# Altium project MAINBOARD.PRJPCB
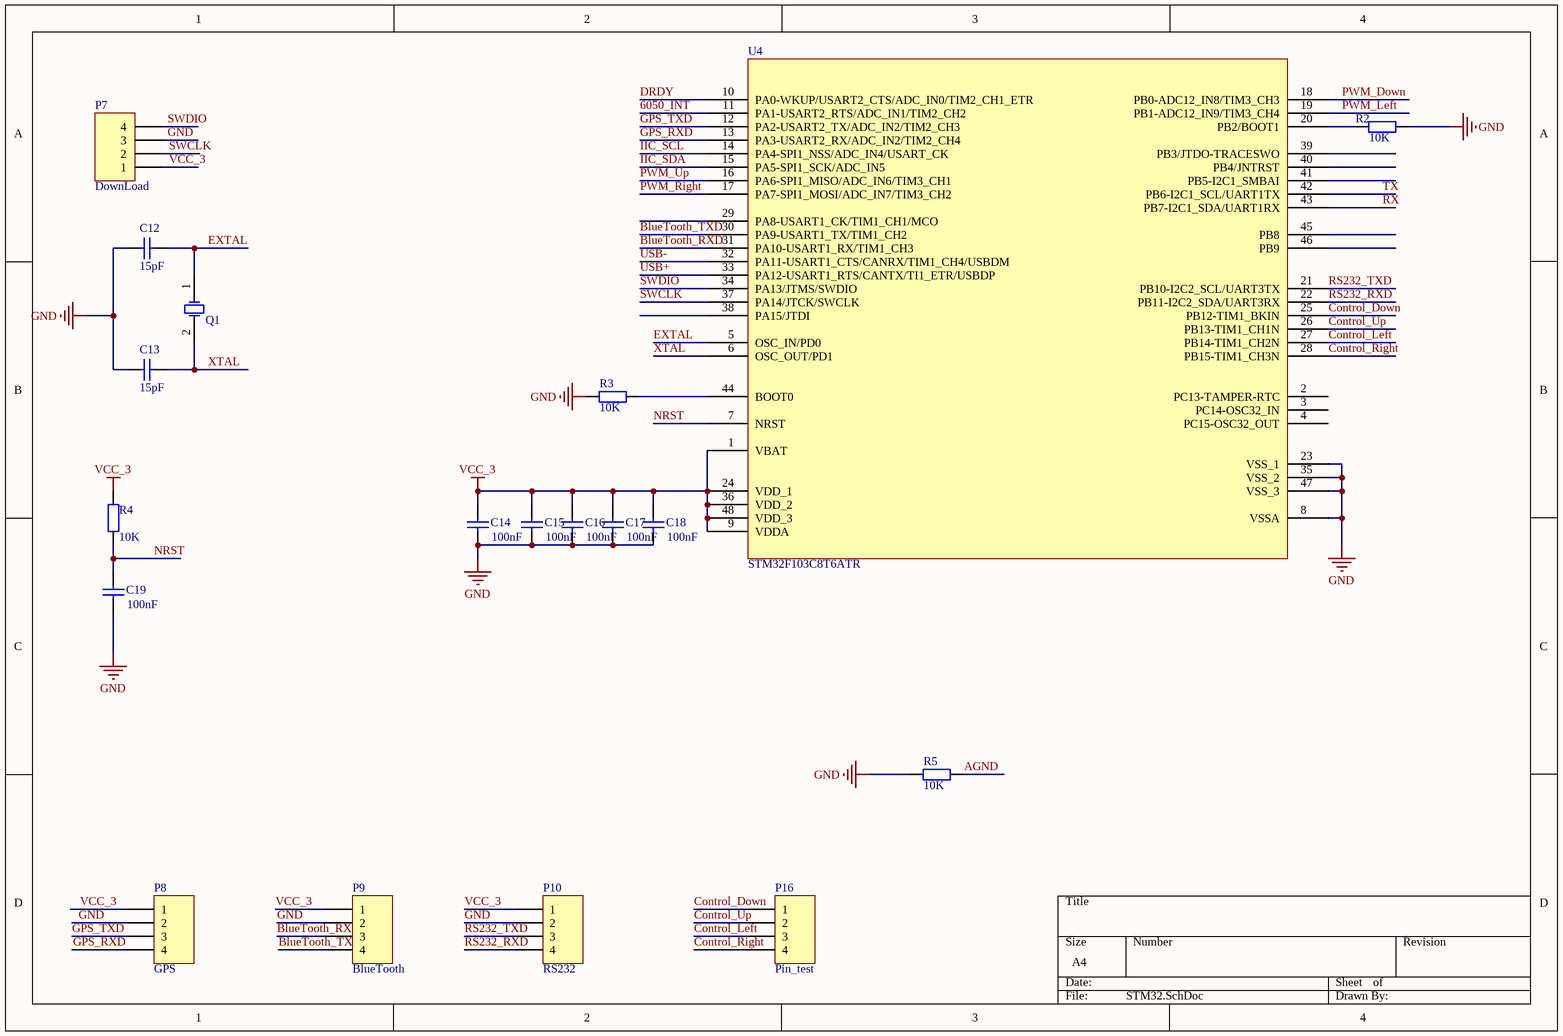
[diagram p0: STM32.SchDoc]
3 sheets, 49 parts. Net scope: global (net labels, ports and power ports of the same name join across sheets).
Board file: mainboard.PcbDoc
Sheets:
  STM32.SchDoc
  mainboard.SchDoc
  power.SchDoc

## Sheet STM32.SchDoc
size A4

### Parts
C12  value 15pF  [0603]  (hidden comment: 1pF)
C13  value 15pF  [0603]  (hidden comment: 1pF)
C14  value 100nF  [0603]  (hidden comment: Cap)
C15  value 100nF  [0603]  (hidden comment: Cap)
C16  value 100nF  [0603]  (hidden comment: Cap)
C17  value 100nF  [0603]  (hidden comment: Cap)
C18  value 100nF  [0603]  (hidden comment: Cap)
C19  value 100nF  [0603]  (hidden comment: Cap)
P7  DownLoad  [HDR1X4]
P8  GPS  [HDR1X4]
P9  BlueTooth  [HDR1X4]
P10  RS232  [HDR1X4]
P16  Pin_test  [HDR1X4]
Q1  XTAL  [xtal-5032]  (value not drawn)
R2  value 10K  [0603]  (hidden comment: Res2)
R3  value 10K  [0603]  (hidden comment: Res2)
R4  value 10K  [0603]  (hidden comment: Res2)
R5  value 10K  [0603]  (hidden comment: Res2)
U4  STM32F103C8T6ATR

### Nets
GND: C12.1 C13.1 C14.1 C15.1 C16.1 C17.1 C18.1 C19.1 P7.3 P8.2 P9.2 P10.2 R2.1 R3.2 R5.2 U4.8(VSSA) U4.23(VSS_1) U4.35(VSS_2) U4.47(VSS_3)
VCC_3: C14.2 C15.2 C16.2 C17.2 C18.2 P7.1 P8.1 P9.1 P10.1 R4.2 U4.1(VBAT) U4.9(VDDA) U4.24(VDD_1) U4.36(VDD_2) U4.48(VDD_3)
6050_INT: U4.11(PA1-USART2_RTS/ADC_IN1/TIM2_CH2)
AGND: R5.1
BlueTooth_RXD: P9.3 U4.31(PA10-USART1_RX/TIM1_CH3)
BlueTooth_TXD: P9.4 U4.30(PA9-USART1_TX/TIM1_CH2)
Control_Down: P16.1 U4.25(PB12-TIM1_BKIN)
Control_Left: P16.3 U4.27(PB14-TIM1_CH2N)
Control_Right: P16.4 U4.28(PB15-TIM1_CH3N)
Control_Up: P16.2 U4.26(PB13-TIM1_CH1N)
DRDY: U4.10(PA0-WKUP/USART2_CTS/ADC_IN0/TIM2_CH1_ETR)
EXTAL: C12.2 Q1.1(OSC1) U4.5(OSC_IN/PD0)
GPS_RXD: P8.4 U4.13(PA3-USART2_RX/ADC_IN2/TIM2_CH4)
GPS_TXD: P8.3 U4.12(PA2-USART2_TX/ADC_IN2/TIM2_CH3)
IIC_SCL: U4.14(PA4-SPI1_NSS/ADC_IN4/USART_CK)
IIC_SDA: U4.15(PA5-SPI1_SCK/ADC_IN5)
NRST: C19.2 R4.1 U4.7(NRST)
PWM_Down: U4.18(PB0-ADC12_IN8/TIM3_CH3)
PWM_Left: U4.19(PB1-ADC12_IN9/TIM3_CH4)
PWM_Right: U4.17(PA7-SPI1_MOSI/ADC_IN7/TIM3_CH2)
PWM_Up: U4.16(PA6-SPI1_MISO/ADC_IN6/TIM3_CH1)
RS232_RXD: P10.4 U4.22(PB11-I2C2_SDA/UART3RX)
RS232_TXD: P10.3 U4.21(PB10-I2C2_SCL/UART3TX)
RX: U4.43(PB7-I2C1_SDA/UART1RX)
SWCLK: P7.2 U4.37(PA14/JTCK/SWCLK)
SWDIO: P7.4 U4.34(PA13/JTMS/SWDIO)
TX: U4.42(PB6-I2C1_SCL/UART1TX)
USB+: U4.33(PA12-USART1_RTS/CANTX/TI1_ETR/USBDP)
USB-: U4.32(PA11-USART1_CTS/CANRX/TIM1_CH4/USBDM)
XTAL: C13.2 Q1.2(OSC2) U4.6(OSC_OUT/PD1)
NetR2_2: R2.2 U4.20(PB2/BOOT1)
NetR3_1: R3.1 U4.44(BOOT0)

Not connected (* = marked no-connect by the designer): U4 2(PC13-TAMPER-RTC) 3(PC14-OSC32_IN) 4(PC15-OSC32_OUT) 29(PA8-USART1_CK/TIM1_CH1/MCO) 38(PA15/JTDI) 39(PB3/JTDO-TRACESWO) 40(PB4/JNTRST) 41(PB5-I2C1_SMBAI) 45(PB8) 46(PB9)

### Library data of the parts
C12 C13 = Cap Semi: Capacitor (Semiconductor SIM Model); Published: 8-Jun-2000; LatestRevisionDate: 17-Jul-2002; LatestRevisionNote: Re-released for DXP Platform.; PackageReference: C1206; Publisher: Altium Limited
C14-C19 = Cap: Capacitor; Published: 8-Jun-2000; LatestRevisionDate: 17-Jul-2002; LatestRevisionNote: Re-released for DXP Platform.; PackageReference: RAD-0.3; Publisher: Altium Limited
P7-P10 P16 = Header 4: Header, 4-Pin; LatestRevisionDate: 17-Jul-2002; LatestRevisionNote: Re-released for DXP Platform.; Publisher: Altium Limited
Q1 = XTAL: Crystal Oscillator; Published: 8-Jun-2000; LatestRevisionDate: 17-Jul-2002; LatestRevisionNote: Re-released for DXP Platform.; PackageReference: R38; Publisher: Altium Limited
R2-R5 = Res2: Resistor; Published: 8-Jun-2000; LatestRevisionDate: 17-Jul-2002; LatestRevisionNote: Re-released for DXP Platform.; PackageReference: AXIAL-0.4; Publisher: Altium Limited

## Sheet mainboard.SchDoc
size A4
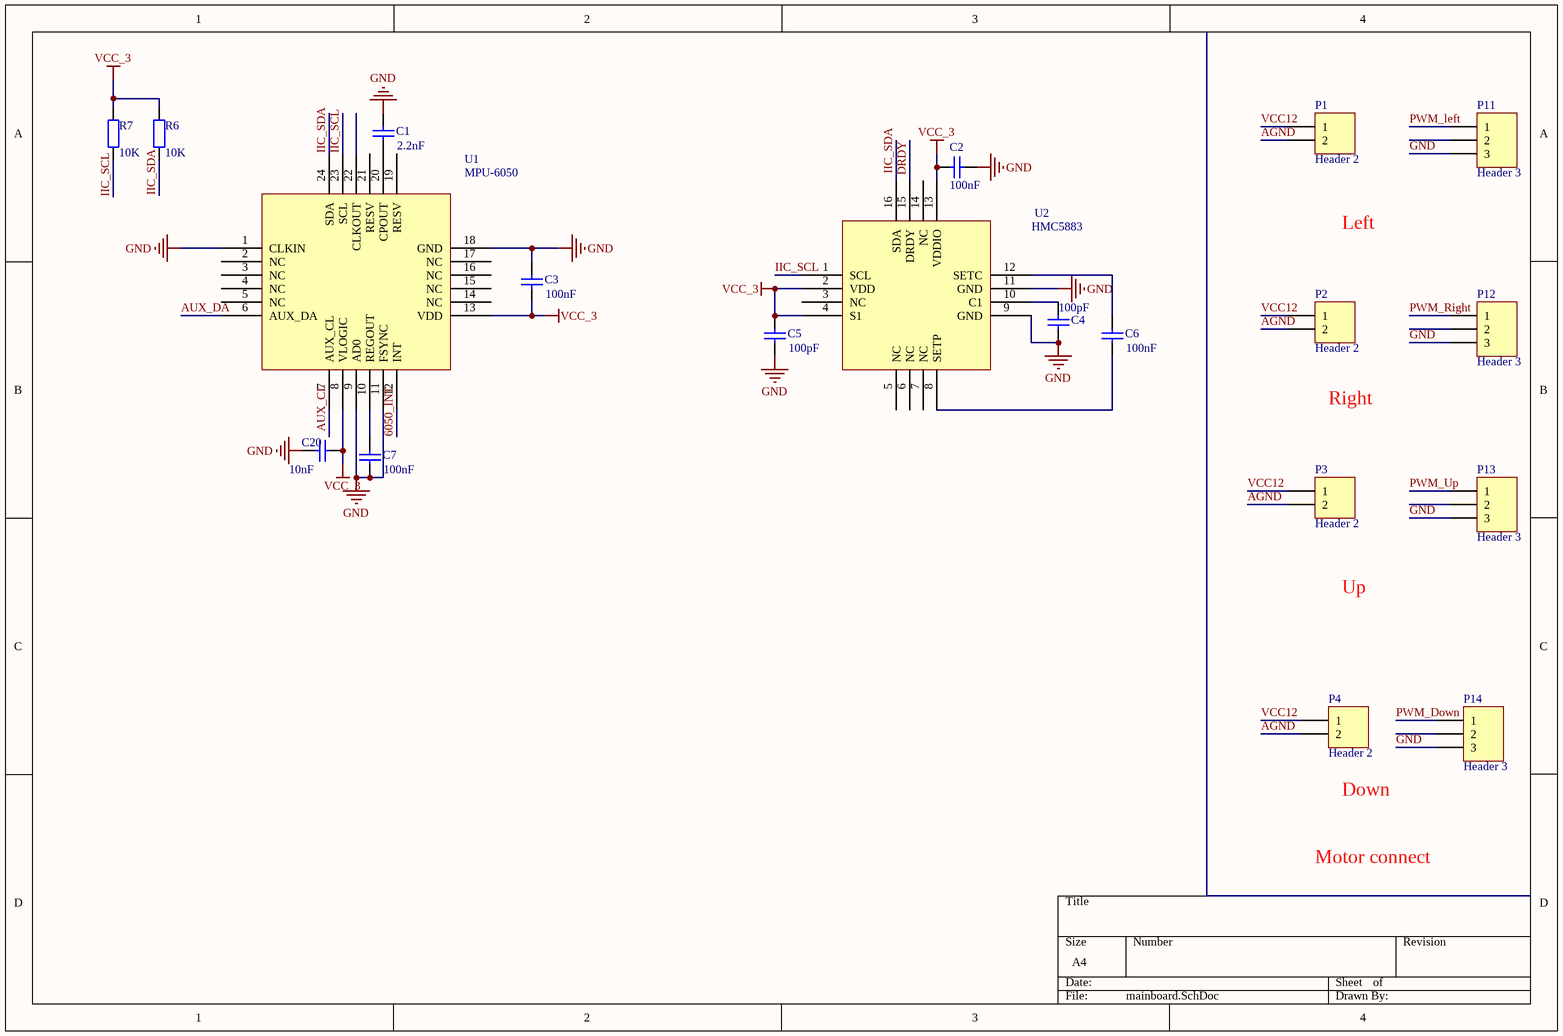
[diagram p1: mainboard.SchDoc]

### Parts
C1  value 2.2nF  [0603]  (hidden comment: Cap)
C2  value 100nF  [0603]  (hidden comment: Cap)
C3  value 100nF  [0603]  (hidden comment: Cap)
C4  value 100pF  [0603]  (hidden comment: Cap)
C5  value 100pF  [0603]  (hidden comment: Cap)
C6  value 100nF  [0603]  (hidden comment: Cap)
C7  value 100nF  [0603]  (hidden comment: Cap)
C20  value 10nF  [0603]  (hidden comment: Cap)
P1  Header 2  [motor connect]
P2  Header 2  [motor connect]
P3  Header 2  [motor connect]
P4  Header 2  [motor connect]
P11  Header 3  [HDR1X3]
P12  Header 3  [HDR1X3]
P13  Header 3  [HDR1X3]
P14  Header 3  [HDR1X3]
R6  value 10K  [0603]  (hidden comment: Res2)
R7  value 10K  [0603]  (hidden comment: Res2)
U1  MPU-6050  [MPU-6050]
U2  HMC5883  [HMC5883L]

### Nets
GND: C1.2 C2.1 C3.2 C4.2 C5.1 C7.1 C20.2 P11.3 P12.3 P13.3 P14.3 U1.1(CLKIN) U1.9(AD0) U1.11(FSYNC) U1.18(GND) U2.9(GND) U2.11(GND)
VCC_3: C2.2 C3.1 C5.2 C20.1 R6.2 R7.2 U1.8(VLOGIC) U1.13(VDD) U2.2(VDD) U2.4(S1) U2.13(VDDIO)
6050_INT: U1.12(INT)
AGND: P1.2 P2.2 P3.2 P4.2
AUX_CL: U1.7(AUX_CL)
AUX_DA: U1.6(AUX_DA)
DRDY: U2.15(DRDY)
IIC_SCL: R7.1 U1.23(SCL) U2.1(SCL)
IIC_SDA: R6.1 U1.24(SDA) U2.16(SDA)
PWM_Down: P14.1
PWM_Left: P11.1
PWM_Right: P12.1
PWM_Up: P13.1
VCC12: P1.1 P2.1 P3.1 P4.1
NetC1_1: C1.1 U1.20(CPOUT)
NetC4_1: C4.1 U2.10(C1)
NetC6_1: C6.1 U2.8(SETP)
NetC6_2: C6.2 U2.12(SETC)
NetC7_2: C7.2 U1.10(REGOUT)

Not connected (* = marked no-connect by the designer): P11 2; P12 2; P13 2; P14 2; U1 2(NC) 3(NC) 4(NC) 5(NC) 14(NC) 15(NC) 16(NC) 17(NC) 19(RESV) 21(RESV) 22(CLKOUT); U2 3(NC) 5(NC) 6(NC) 7(NC) 14(NC)

### Notes on the sheet
- Left
- Right
- Up
- (near P4) Down
- Motor connect

### Library data of the parts
C1-C7 C20 = Cap: Capacitor; Published: 8-Jun-2000; LatestRevisionDate: 17-Jul-2002; LatestRevisionNote: Re-released for DXP Platform.; PackageReference: RAD-0.3; Publisher: Altium Limited
P1-P4 = Header 2: Header, 2-Pin; LatestRevisionDate: 17-Jul-2002; LatestRevisionNote: Re-released for DXP Platform.; Publisher: Altium Limited
P11-P14 = Header 3: Header, 3-Pin; LatestRevisionDate: 17-Jul-2002; LatestRevisionNote: Re-released for DXP Platform.; Publisher: Altium Limited
R6 R7 = Res2: Resistor; Published: 8-Jun-2000; LatestRevisionDate: 17-Jul-2002; LatestRevisionNote: Re-released for DXP Platform.; PackageReference: AXIAL-0.4; Publisher: Altium Limited

## Sheet power.SchDoc
size A4
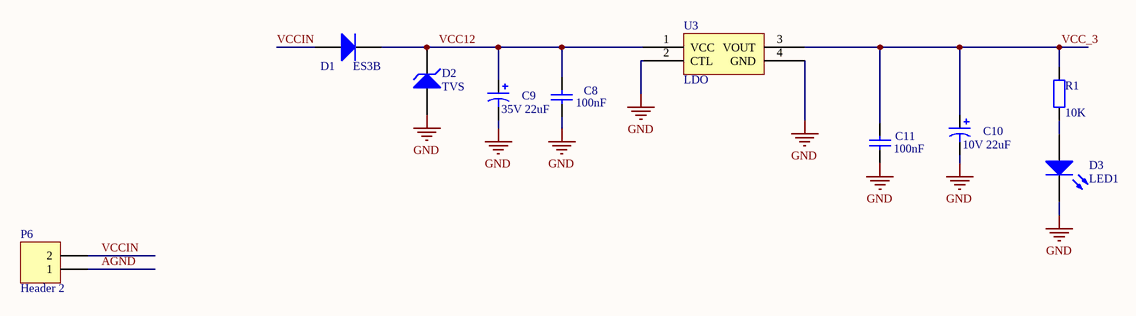
[diagram p2: power.SchDoc]

### Parts
C8  100nF  [0603]
C9  value 35V 22uF  [CAP_6.3_5.8]  (hidden comment: 10uF)
C10  value 10V 22uF  [1206]  (hidden comment: 10uF 10-35V)
C11  100nF  [0603]
D1  ES3B  [DO-214AC]
D2  TVS  [DO-214AC]
D3  LED1  [LED0603]
P6  Header 2  [KL]
R1  value 10K  [0603]  (hidden comment: Res2)
U3  LDO  [SOT-223]

### Nets
GND: C8.1 C9.2 C10.2 C11.1 D2.1(A) D3.2(K) U3.2(CTL) U3.4(GND)
VCC_3: C10.1 C11.2 R1.2 U3.3(VOUT)
AGND: P6.1
VCC12: C8.2 C9.1 D1.2(K) D2.2(K) U3.1(VCC)
VCCIN: D1.1(A) P6.2
NetD3_1: D3.1(A) R1.1

### Library data of the parts
C8 C11 = Cap Semi: Capacitor (Semiconductor SIM Model); Published: 8-Jun-2000; LatestRevisionDate: 17-Jul-2002; LatestRevisionNote: Re-released for DXP Platform.; PackageReference: C1206; Publisher: Altium Limited; Value: 100nF
C9 C10 = Cap Pol3: Polarized Capacitor (Surface Mount); Published: 8-Jun-2000; LatestRevisionDate: 17-Jul-2002; LatestRevisionNote: Re-released for DXP Platform.; PackageReference: C0805; Publisher: Altium Limited
D1 = Diode: Default Diode; Published: 8-Jun-2000; LatestRevisionDate: 17-Jul-2002; LatestRevisionNote: Re-released for DXP Platform.; PackageDocument: Sep-1996; PackageReference: SMC; Publisher: Altium Limited; Code_JEDEC: DO-214-AB
D2 = D Zener: Zener Diode; Published: 8-Jun-2000; LatestRevisionDate: 17-Jul-2002; LatestRevisionNote: Re-released for DXP Platform.; PackageReference: DIODE-0.7; Publisher: Altium Limited
D3 = LED1: Typical RED GaAs LED; Published: 8-Jun-2000; LatestRevisionDate: 08-Jul-2005; LatestRevisionNote: Mech Layer 1 removed.; PackageReference: LED-1; Publisher: Altium Limited
P6 = Header 2: Header, 2-Pin; LatestRevisionDate: 17-Jul-2002; LatestRevisionNote: Re-released for DXP Platform.; Publisher: Altium Limited
R1 = Res2: Resistor; Published: 8-Jun-2000; LatestRevisionDate: 17-Jul-2002; LatestRevisionNote: Re-released for DXP Platform.; PackageReference: AXIAL-0.4; Publisher: Altium Limited

## Nets that join several sheets
GND: STM32 (19 pins), mainboard (17 pins), power (8 pins)
VCC_3: STM32 (15 pins), mainboard (11 pins), power (C10.1 C11.2 R1.2 U3.3)
6050_INT: STM32 (U4.11), mainboard (U1.12)
AGND: STM32 (R5.1), mainboard (P1.2 P2.2 P3.2 P4.2), power (P6.1)
DRDY: STM32 (U4.10), mainboard (U2.15)
IIC_SCL: STM32 (U4.14), mainboard (R7.1 U1.23 U2.1)
IIC_SDA: STM32 (U4.15), mainboard (R6.1 U1.24 U2.16)
PWM_Down: STM32 (U4.18), mainboard (P14.1)
PWM_Left: STM32 (U4.19), mainboard (P11.1)
PWM_Right: STM32 (U4.17), mainboard (P12.1)
PWM_Up: STM32 (U4.16), mainboard (P13.1)
VCC12: mainboard (P1.1 P2.1 P3.1 P4.1), power (5 pins)